# Altium schematic sheet SL_LoRa_Schematic.SchDoc: TestBoard
size A4
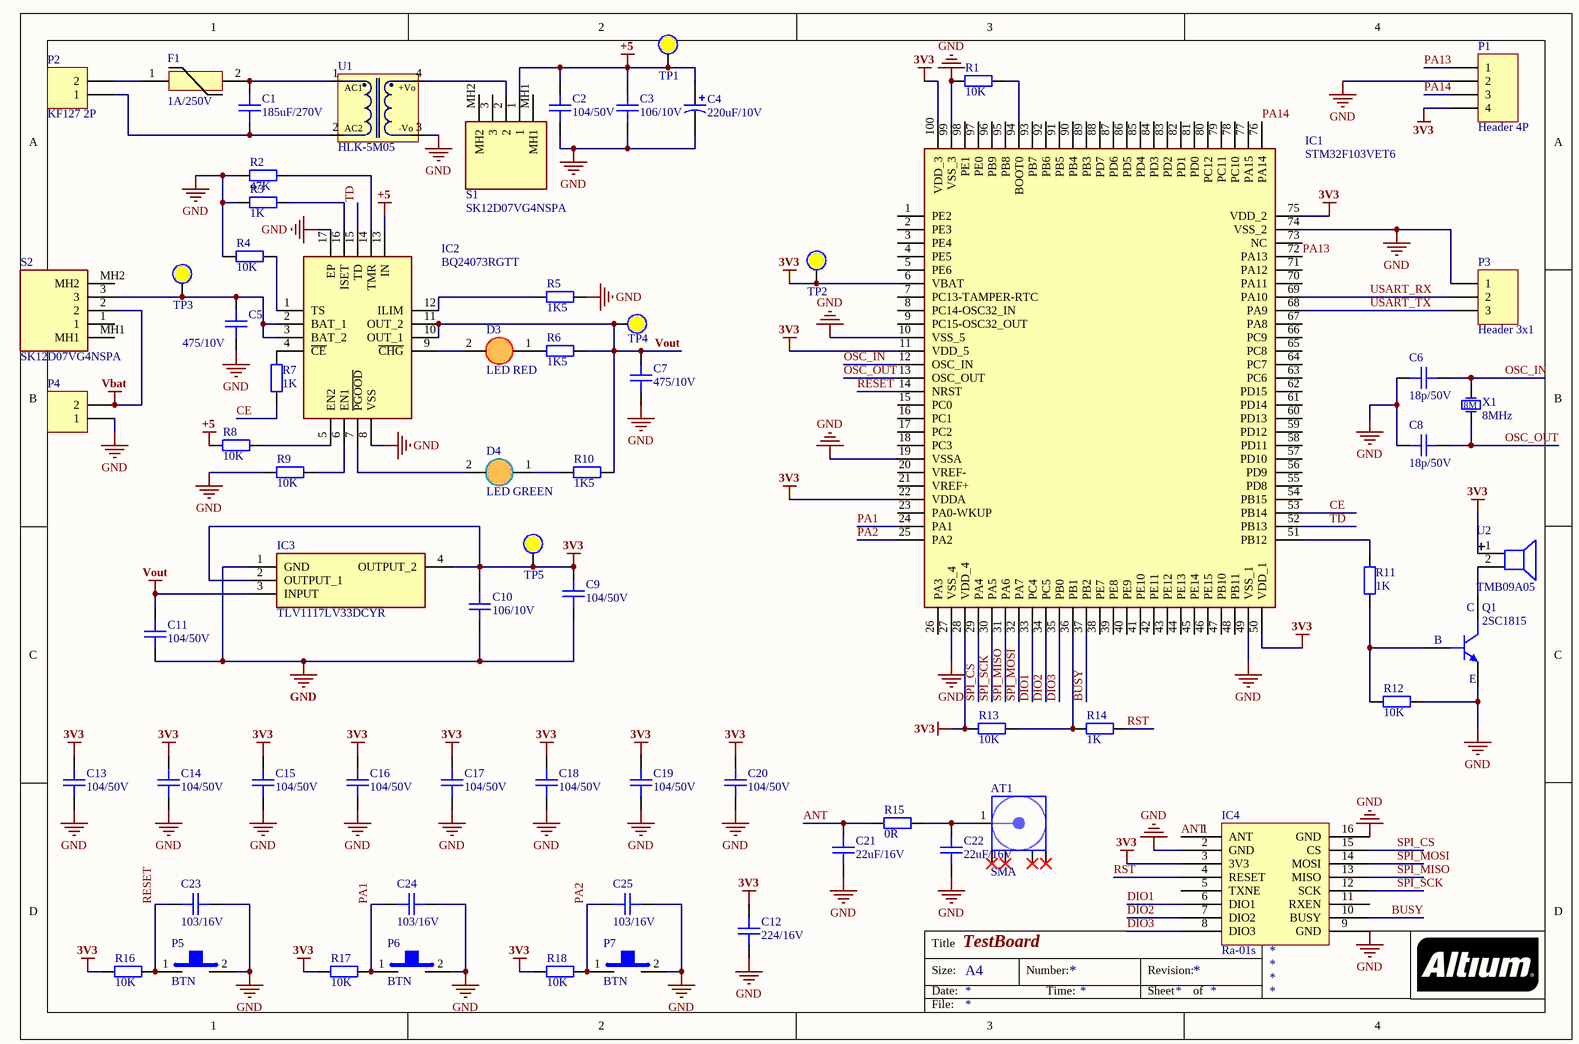
[diagram p0: SL_LoRa_Schematic.SchDoc]

## Parts
AT1  SMA  [SMA-KWE-17-V1]
C1  185uF/270V  [10d471k]
C2  104/50V  [CAPC-0603 (1608)]
C3  106/10V  [CAPC-0603 (1608)]
C4  220uF/10V  [CAP_ALUM_D050_S20_H110]
C5  475/10V  [CAPC-0603 (1608)]
C6  18p/50V  [CAPC-0603 (1608)]
C7  475/10V  [CAPC-0603 (1608)]
C8  18p/50V  [CAPC-0603 (1608)]
C9  104/50V  [CAPC-0603 (1608)]
C10  106/10V  [CAPC-0603 (1608)]
C11  104/50V  [CAPC-0603 (1608)]
C12  224/16V  [CAPC-0603 (1608)]
C13  104/50V  [CAPC-0603 (1608)]
C14  104/50V  [CAPC-0603 (1608)]
C15  104/50V  [CAPC-0603 (1608)]
C16  104/50V  [CAPC-0603 (1608)]
C17  104/50V  [CAPC-0603 (1608)]
C18  104/50V  [CAPC-0603 (1608)]
C19  104/50V  [CAPC-0603 (1608)]
C20  104/50V  [CAPC-0603 (1608)]
C21  22uF/16V  [CAPC-0603 (1608)]
C22  22uF/16V  [CAPC-0603 (1608)]
C23  103/16V  [CAPC-0603 (1608)]
C24  103/16V  [CAPC-0603 (1608)]
C25  103/16V  [CAPC-0603 (1608)]
D3  LED RED  [LED_3MM-RED]
D4  LED GREEN  [LED_3MM-GREEN]
F1  1A/250V  [FUSE-1A/250V]
IC1  STM32F103VET6  [QFP50P1600X1600X160-100N]
IC2  BQ24073RGTT  [QFN50P300X300X100-17N-D]
IC3  TLV1117LV33DCYR  [SOT230P700X180-4N]
IC4  Ra-01s  [Ra-01s]
P1  Header 4P  [HDR1X4]
P2  KF127 2P  [KF127_2P]
P3  Header 3x1  [HDR1X3]
P4  (no value)  [HDR200_1x2]
P5  BTN  [Button 6x6x8mm]
P6  BTN  [Button 6x6x8mm]
P7  BTN  [Button 6x6x8mm]
Q1  2SC1815  [SOT23_3]
R1  10K  [RESC-0603 (1608)]
R2  47K  [RESC-0603 (1608)]
R3  1K  [RESC-0603 (1608)]
R4  10K  [RESC-0603 (1608)]
R5  1K5  [RESC-0603 (1608)]
R6  1K5  [RESC-0603 (1608)]
R7  1K  [RESC-0603 (1608)]
R8  10K  [RESC-0603 (1608)]
R9  10K  [RESC-0603 (1608)]
R10  1K5  [RESC-0603 (1608)]
R11  1K  [RESC-0603 (1608)]
R12  10K  [RESC-0603 (1608)]
R13  10K  [RESC-0603 (1608)]
R14  1K  [RESC-0603 (1608)]
R15  0R  [RESC-0603 (1608)]
R16  10K  [RESC-0603 (1608)]
R17  10K  [RESC-0603 (1608)]
R18  10K  [RESC-0603 (1608)]
S1  SK12D07VG4NSPA  [SK12D07VG4NSPA]
S2  SK12D07VG4NSPA  [SK12D07VG4NSPA]
TP1  (no value)  [Test Point 1 Side]  (no BOM)
TP2  (no value)  [Test Point 1 Side]  (no BOM)
TP3  (no value)  [Test Point 1 Side]  (no BOM)
TP4  (no value)  [Test Point 1 Side]  (no BOM)
TP5  (no value)  [Test Point 1 Side]  (no BOM)
U1  HLK-5M05  [HLK-5M05]
U2  TMB09A05  [BUZZER_D9_TH]
X1  8MHz  [CRYSTAL_ABM3 5x3.2mm]

## Nets
3V3: C9.2 C10.2 C12.1 C13.2 C14.2 C15.2 C16.2 C17.2 C18.2 C19.2 C20.2 IC1.6(VBAT) IC1.11(VDD_5) IC1.22(VDDA) IC1.28(VDD_4) IC1.50(VDD_1) IC1.75(VDD_2) IC1.100(VDD_3) IC3.2(OUTPUT_1) IC3.4(OUTPUT_2) IC4.3(3V3) P1.4 R13.1 R16.1 R17.1 R18.1 TP2.0 TP5.0 U2.1
+5: C2.2 C3.2 C4.1 IC2.13(IN) R8.2 S1.1 TP1.0
GND: C2.1 C3.1 C4.2 C5.1 C6.1 C7.1 C8.1 C9.1 C10.1 C11.1 C12.2 C13.1 C14.1 C15.1 C16.1 C17.1 C18.1 C19.1 C20.1 C21.1 C22.1 C23.2 C24.2 C25.2 IC1.10(VSS_5) IC1.19(VSSA) IC1.27(VSS_4) IC1.49(VSS_1) IC1.74(VSS_2) IC1.99(VSS_3) IC2.8(VSS) IC2.17(EP) IC3.1(GND) IC4.2(GND) IC4.9(GND) IC4.16(GND) P1.2 P3.1 P4.1 P5.2 P6.2 P7.2 Q1.2(E) R1.1 R2.1 R3.2 R4.1 R5.2 R9.2 R12.2 U1.3
Vbat: P4.2 S2.2
Vout: C7.2 C11.2 IC2.10(OUT_1) IC2.11(OUT_2) IC3.3(INPUT) R6.1 R10.1 TP4.0
ANT: C21.2 IC4.1(ANT) R15.1
BUSY: IC1.37(PB2) IC4.10(BUSY)
CE: IC1.53(PB14) R7.1
DIO1: IC1.33(PC4) IC4.6(DIO1)
DIO2: IC1.34(PC5) IC4.7(DIO2)
DIO3: IC1.35(PB0) IC4.8(DIO3)
OSC_IN: C6.2 IC1.12(OSC_IN) X1.1(OSC1)
OSC_OUT: C8.2 IC1.13(OSC_OUT) X1.2(OSC2)
PA1: C24.1 IC1.24(PA1) P6.1 R17.2
PA2: C25.1 IC1.25(PA2) P7.1 R18.2
PA13: IC1.72(PA13) P1.1
PA14: IC1.76(PA14) P1.3
RESET: C23.1 IC1.14(NRST) P5.1 R16.2
RST: IC4.4(RESET) R14.2
SPI_CS: IC1.29(PA4) IC4.15(CS)
SPI_MISO: IC1.31(PA6) IC4.13(MISO)
SPI_MOSI: IC1.32(PA7) IC4.14(MOSI)
SPI_SCK: IC1.30(PA5) IC4.12(SCK)
TD: IC1.52(PB13) IC2.15(TD)
USART_RX: IC1.69(PA10) P3.2
USART_TX: IC1.68(PA9) P3.3
NetAT1_1: AT1.1(Signal) C22.2 R15.2
NetC1_1: C1.1 F1.2 U1.1(AC)
NetC1_2: C1.2 P2.1 U1.2
NetC5_2: C5.2 IC2.2(BAT_1) IC2.3(BAT_2) S2.3 TP3.0
NetD3_1: D3.1(A) R6.2
NetD3_2: D3.2(K) IC2.9(~{CHG})
NetD4_1: D4.1(A) R10.2
NetD4_2: D4.2(K) IC2.7(~{PGOOD})
NetF1_1: F1.1 P2.2
NetIC1_36: IC1.36(PB1) R13.2 R14.1
NetIC1_51: IC1.51(PB12) R11.2
NetIC1_94: IC1.94(BOOT0) R1.2
NetIC2_1: IC2.1(TS) R4.2
NetIC2_4: IC2.4(~{CE}) R7.2
NetIC2_5: IC2.5(EN2) R8.1
NetIC2_6: IC2.6(EN1) R9.1
NetIC2_12: IC2.12(ILIM) R5.1
NetIC2_14: IC2.14(TMR) R2.2
NetIC2_16: IC2.16(ISET) R3.1
NetQ1_1: Q1.1(B) R11.1 R12.1
NetQ1_3: Q1.3(C) U2.2
NetS1_2: S1.2 U1.4

Not connected (* = marked no-connect by the designer): AT1 2*; IC1 1(PE2) 2(PE3) 3(PE4) 4(PE5) 5(PE6) 7(PC13-TAMPER-RTC) 8(PC14-OSC32_IN) 9(PC15-OSC32_OUT) 15(PC0) 16(PC1) 17(PC2) 18(PC3) 20(VREF-) 21(VREF+) 23(PA0-WKUP) 26(PA3) 38(PE7) 39(PE8) 40(PE9) 41(PE10) 42(PE11) 43(PE12) 44(PE13) 45(PE14) 46(PE15) 47(PB10) 48(PB11) 54(PB15) 55(PD8) 56(PD9) 57(PD10) 58(PD11) 59(PD12) 60(PD13) 61(PD14) 62(PD15) 63(PC6) 64(PC7) 65(PC8) 66(PC9) 67(PA8) 70(PA11) 71(PA12) 73(NC) 77(PA15) 78(PC10) 79(PC11) 80(PC12) 81(PD0) 82(PD1) 83(PD2) 84(PD3) 85(PD4) 86(PD5) 87(PD6) 88(PD7) 89(PB3) 90(PB4) 91(PB5) 92(PB6) 93(PB7) 95(PB8) 96(PB9) 97(PE0) 98(PE1); IC4 5(TXNE) 11(RXEN); S1 3 MH1 MH2; S2 1 MH1 MH2

## Notes on the sheet
- Title
- Size:
- Date:
- A4
- Number:
- Time:
- Revision:
- Sheet
- of
- File:
- (in symbol ABM3-8.000MHZ-D2Y-T) 8M
- (in symbol HLK-5M05) AC1; +Vo; AC2; -Vo

## Library data of the parts
AT1 = SMA-KWE-17-V1: Solder: WAVE; MPN: SMA-KWE-17-V1
C1 = 7D271K: Solder: WAVE; Category: CAPACITOR; MPN: 7D271K; PinCount: 2; Value: 185uF/270V
C2 C9 C11 C13-C20 = C0603C104K5RACTU: CAP CER 0.1uF 50V 10% X7R 0603; Solder: SMT; MPN: C0603C104K5RACTU; Value: 104/50V; Category: CAPACITOR; PinCount: 2
C3 C10 = CL10A106KP8NNNC: CAP CER 10uF 10% 10V X5R 0603; Solder: SMT; MPN: CL10A106KP8NNNC; Value: 106/10V; Category: CAPACITOR; PinCount: 2
C4 = CLA0920: CAP ALUM 220uF 20% 10V RADIAL; Value: 220uF/35V; Solder: WAVE; MPN: CLA0920; Category: CAPACITOR; MFR_URL: http://linhkienchatluong.vn/tu-hoa-co-phan-cuc/tu-hoa-10v-220uf_sp454_ct825.aspx; PinCount: 2
C5 C7 = CL10A475KP8NNNC: CAP CER 4.7uF 10% 10V X5R 0603; Solder: SMT; MPN: CL10A475KP8NNNC; Value: 475/10V; Category: CAPACITOR; PinCount: 2
C6 C8 = CL10C180JB8NNNC: CAP CER 18pF 5% 50V C0G/NP0 0603; Solder: SMT; Value: 18p/50V; MPN: CL10C180JB8NNNC; Category: CAPACITOR; PinCount: 2
C12 = CC0603KRX7R7BB224: CAP CER 0.22UF 16V X7R 0603; MFR: Yageo; Solder: SMT; Value: 224/16V; MPN: CC0603KRX7R7BB224; Category: CAPACITOR; PinCount: 2
C21 C22 = CL10A226MO7JZNC: CAP CER 22UF 16V X5R 0603; Solder: SMT; MPN: CL10A226MO7JZNC; Value: 22uF/16V; Category: CAPACITOR; PinCount: 2
C23-C25 = CC0603KRX7R7BB103: CAP CER 10nF 16V 10% X7R 0603; Solder: SMT; MPN: CC0603KRX7R7BB103; Value: 103/16V; Category: CAPACITOR; PinCount: 2
D3 = WP710A10SRC/E: LED RED CLEAR 3MM ROUND T/H; Solder: WAVE; MPN: WP710A10SRC/E; Value: LED RED
D4 = OVLBG4C7: LED GREEN CLEAR 3MM ROUND T/H; Solder: WAVE; MPN: OVLBG4C7; Value: LED GREEN
F1 = FUSE-1A/250V: FUSE POLYSWITCH RUE SERIES 1A 250V; MPN: CLA2772; Solder: WAVE; Value: 1A/250V
IC1 = STM32F103VET6: Integrated Circuit; Manufacturer_Name: STMicroelectronics; Datasheet Link: http://www.st.com/st-web-ui/static/active/en/resource/technical/document/datasheet/CD00191185.pdf; Height: 1.6mm; Manufacturer_Part_Number: STM32F103VET6
IC2 = BQ24073RGTT: Integrated Circuit; Manufacturer_Name: Texas Instruments; Datasheet Link: http://www.ti.com/lit/gpn/bq24073; Height: 1mm; Mouser2 Part Number: 595-BQ24073RGTT; Mouser2 Price/Stock: https://www.mouser.com/Search/Refine.aspx?Keyword=595-BQ24073RGTT; Manufacturer_Part_Number: BQ24073RGTT
IC3 = TLV1117LV33DCYR: Integrated Circuit; Manufacturer_Name: Texas Instruments; Datasheet Link: http://www.ti.com/lit/gpn/tlv1117lv; Height: 1.8mm; Mouser2 Part Number: 595-TLV1117LV33DCYR; Mouser2 Price/Stock: https://www.mouser.com/Search/Refine.aspx?Keyword=595-TLV1117LV33DCYR; Manufacturer_Part_Number: TLV1117LV33DCYR
IC4 = ra-01s: LoRa modem high sensitivity -148 dBm, power output of +22dBm; MRF: Ai-Thinker; Solder: SMT; Category: MODULE; MPN: Ra-01s; Value: Ra-01s; PinCount: 16
P1 = Header 4x1: Header, 4 Pin Pitch 2.54mm; MPN: S1012EC-40-ND; Solder: WAVE; Value: Header 4P
P2 = KF127 2P: Header, 2-Pin, pitch 5.08mm; MPN: KF127-2P; Solder: WAVE
P3 = Header 3x1: Header, 3-Pin, pitch 2.54mm; Solder: WAVE
P4 = H2x1_2.0: Header 2x1, pitch 2mm; Solder: WAVE
P5-P7 = Button 6x6x8mm
Q1 = 2SC1815: TRANS NPN 50V 0.15A SOT23-3; Solder: SMT; MPN: 2SC1815; Value: 2SC1815
R1 R4 R8 R9 R12 R13 R16-R18 = RC0603FR-0710KL: RES SMD 10K OHM 1% 1/10W 0603; CompanyID: VT00464; Solder: SMT; MPN: RC0603FR-0710KL; Value: 10K; Category: RESISTOR
R2 = RC0603FR0747KL: RES SMD 47K OHM 1% 1/10W 0603; Solder: SMT; Value: 47K; MPN: RC0603FR0747KL; Category: RESISTOR
R3 R7 R11 R14 = RC0603FR-071KL: RES SMD 1 KOHM 1% 1/10W 0603; CompanyID: VT00432; Solder: SMT; MPN: RC0603FR-071KL; Value: 1K; Category: RESISTOR
R5 R6 R10 = RC0603FR-071K5L: RES SMD 1.5K OHM 1% 1/10W 0603; CompanyID: VT00423; Solder: SMT; MPN: RC0603FR-071K5L; Value: 1K5; Category: RESISTOR
R15 = RC0603FR-070RL: RES SMD 0.0OHM JUMPER 1/10W 0603; Solder: SMT; MPN: RC0603FR-070RL; Value: 0R; Category: RESISTOR
S1 S2 = SK12D07VG4NSPA: Switch; Manufacturer_Name: C & K COMPONENTS; Datasheet Link: https://componentsearchengine.com//SK12D07VG4NSPA.pdf; Height: 4.7mm; Mouser2 Part Number: 611-SK12D07VG4NSPA; Mouser2 Price/Stock: https://www.mouser.com/Search/Refine.aspx?Keyword=611-SK12D07VG4NSPA; Manufacturer_Part_Number: SK12D07VG4NSPA
TP1-TP5 = Test Point: Solder: NF
U1 = HLK-5M05: Ultra-compact module power 12V/5W; MFR: Hi-link; Solder: WAVE; Value: 5V/5W; Category: MODULE; MPN: HLK-5M05; PinCount: 4
U2 = BUZZER TMB09A05: Còi chíp 5V TMB09A05 9x5.5mm
X1 = ABM3-8.000MHZ-D2Y-T: CRYSTAL 8.0000MHZ 18pF SMD; Solder: SMT; CompanyID: VT00157; Value: 8MHz; MPN: ABM3-8.000MHZ-D2Y-T; Category: CRYSTAL